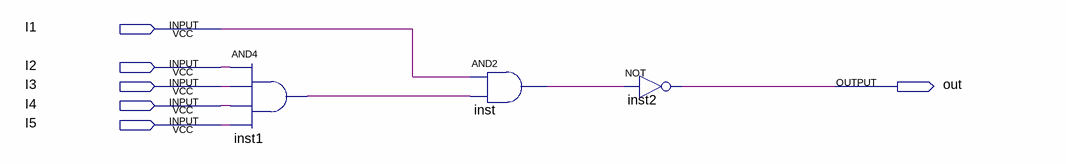
[diagram p0: schematic sheet]
// Quartus schematic NAND5.bdf as structural Verilog: 3 symbols, 6 pins
module NAND5 (
  input  I1,
  input  I2,
  input  I3,
  input  I4,
  input  I5,
  output out
);

  wire inst1_out, inst_out;

  and inst1 (inst1_out, I2, I3, I4, I5);
  and inst (inst_out, I1, inst1_out);
  not inst2 (out, inst_out);
endmodule
